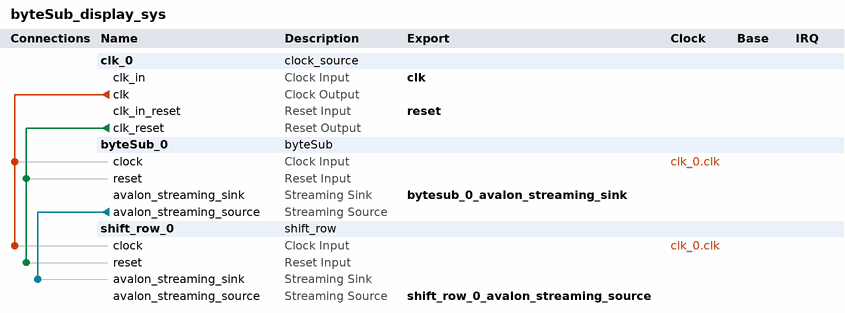
[diagram p0: system contents]
# Platform Designer (Qsys) system byteSub_display_sys, MAX 10 10M50DAF484C7G
# Parameters at their usual value, and those the tool derives, are not listed.
package require -exact qsys 18.0
create_system byteSub_display_sys
set_project_property DEVICE_FAMILY {MAX 10}
set_project_property DEVICE 10M50DAF484C7G

add_instance clk_0 clock_source 18.0
set_instance_parameter_value clk_0 clockFrequency 50000000

add_instance byteSub_0 byteSub 1.0

add_instance shift_row_0 shift_row 1.0

# connections
add_connection clk_0.clk byteSub_0.clock clock
add_connection clk_0.clk shift_row_0.clock clock
add_connection clk_0.clk_reset byteSub_0.reset reset
add_connection clk_0.clk_reset shift_row_0.reset reset
add_connection byteSub_0.avalon_streaming_source shift_row_0.avalon_streaming_sink avalon_streaming

# exported interfaces
add_interface bytesub_0_avalon_streaming_sink avalon_streaming sink
set_interface_property bytesub_0_avalon_streaming_sink EXPORT_OF byteSub_0.avalon_streaming_sink
add_interface clk clock sink
set_interface_property clk EXPORT_OF clk_0.clk_in
add_interface reset reset sink
set_interface_property reset EXPORT_OF clk_0.clk_in_reset
add_interface shift_row_0_avalon_streaming_source avalon_streaming source
set_interface_property shift_row_0_avalon_streaming_source EXPORT_OF shift_row_0.avalon_streaming_source

set_interconnect_requirement {$system} qsys_mm.clockCrossingAdapter HANDSHAKE
set_interconnect_requirement {$system} qsys_mm.enableEccProtection FALSE
set_interconnect_requirement {$system} qsys_mm.insertDefaultSlave FALSE
set_interconnect_requirement {$system} qsys_mm.maxAdditionalLatency 1

save_system byteSub_display_sys.qsys
